# EasyEDA schematic SCH_BusTemp_2026-09-07.json
TITLE: Sheet_1; REV: 1.0; Date: 2021-08-14; Sheet: 1/1; Drawn By: Ananthapadmanaban gururajan; Company: Your Company
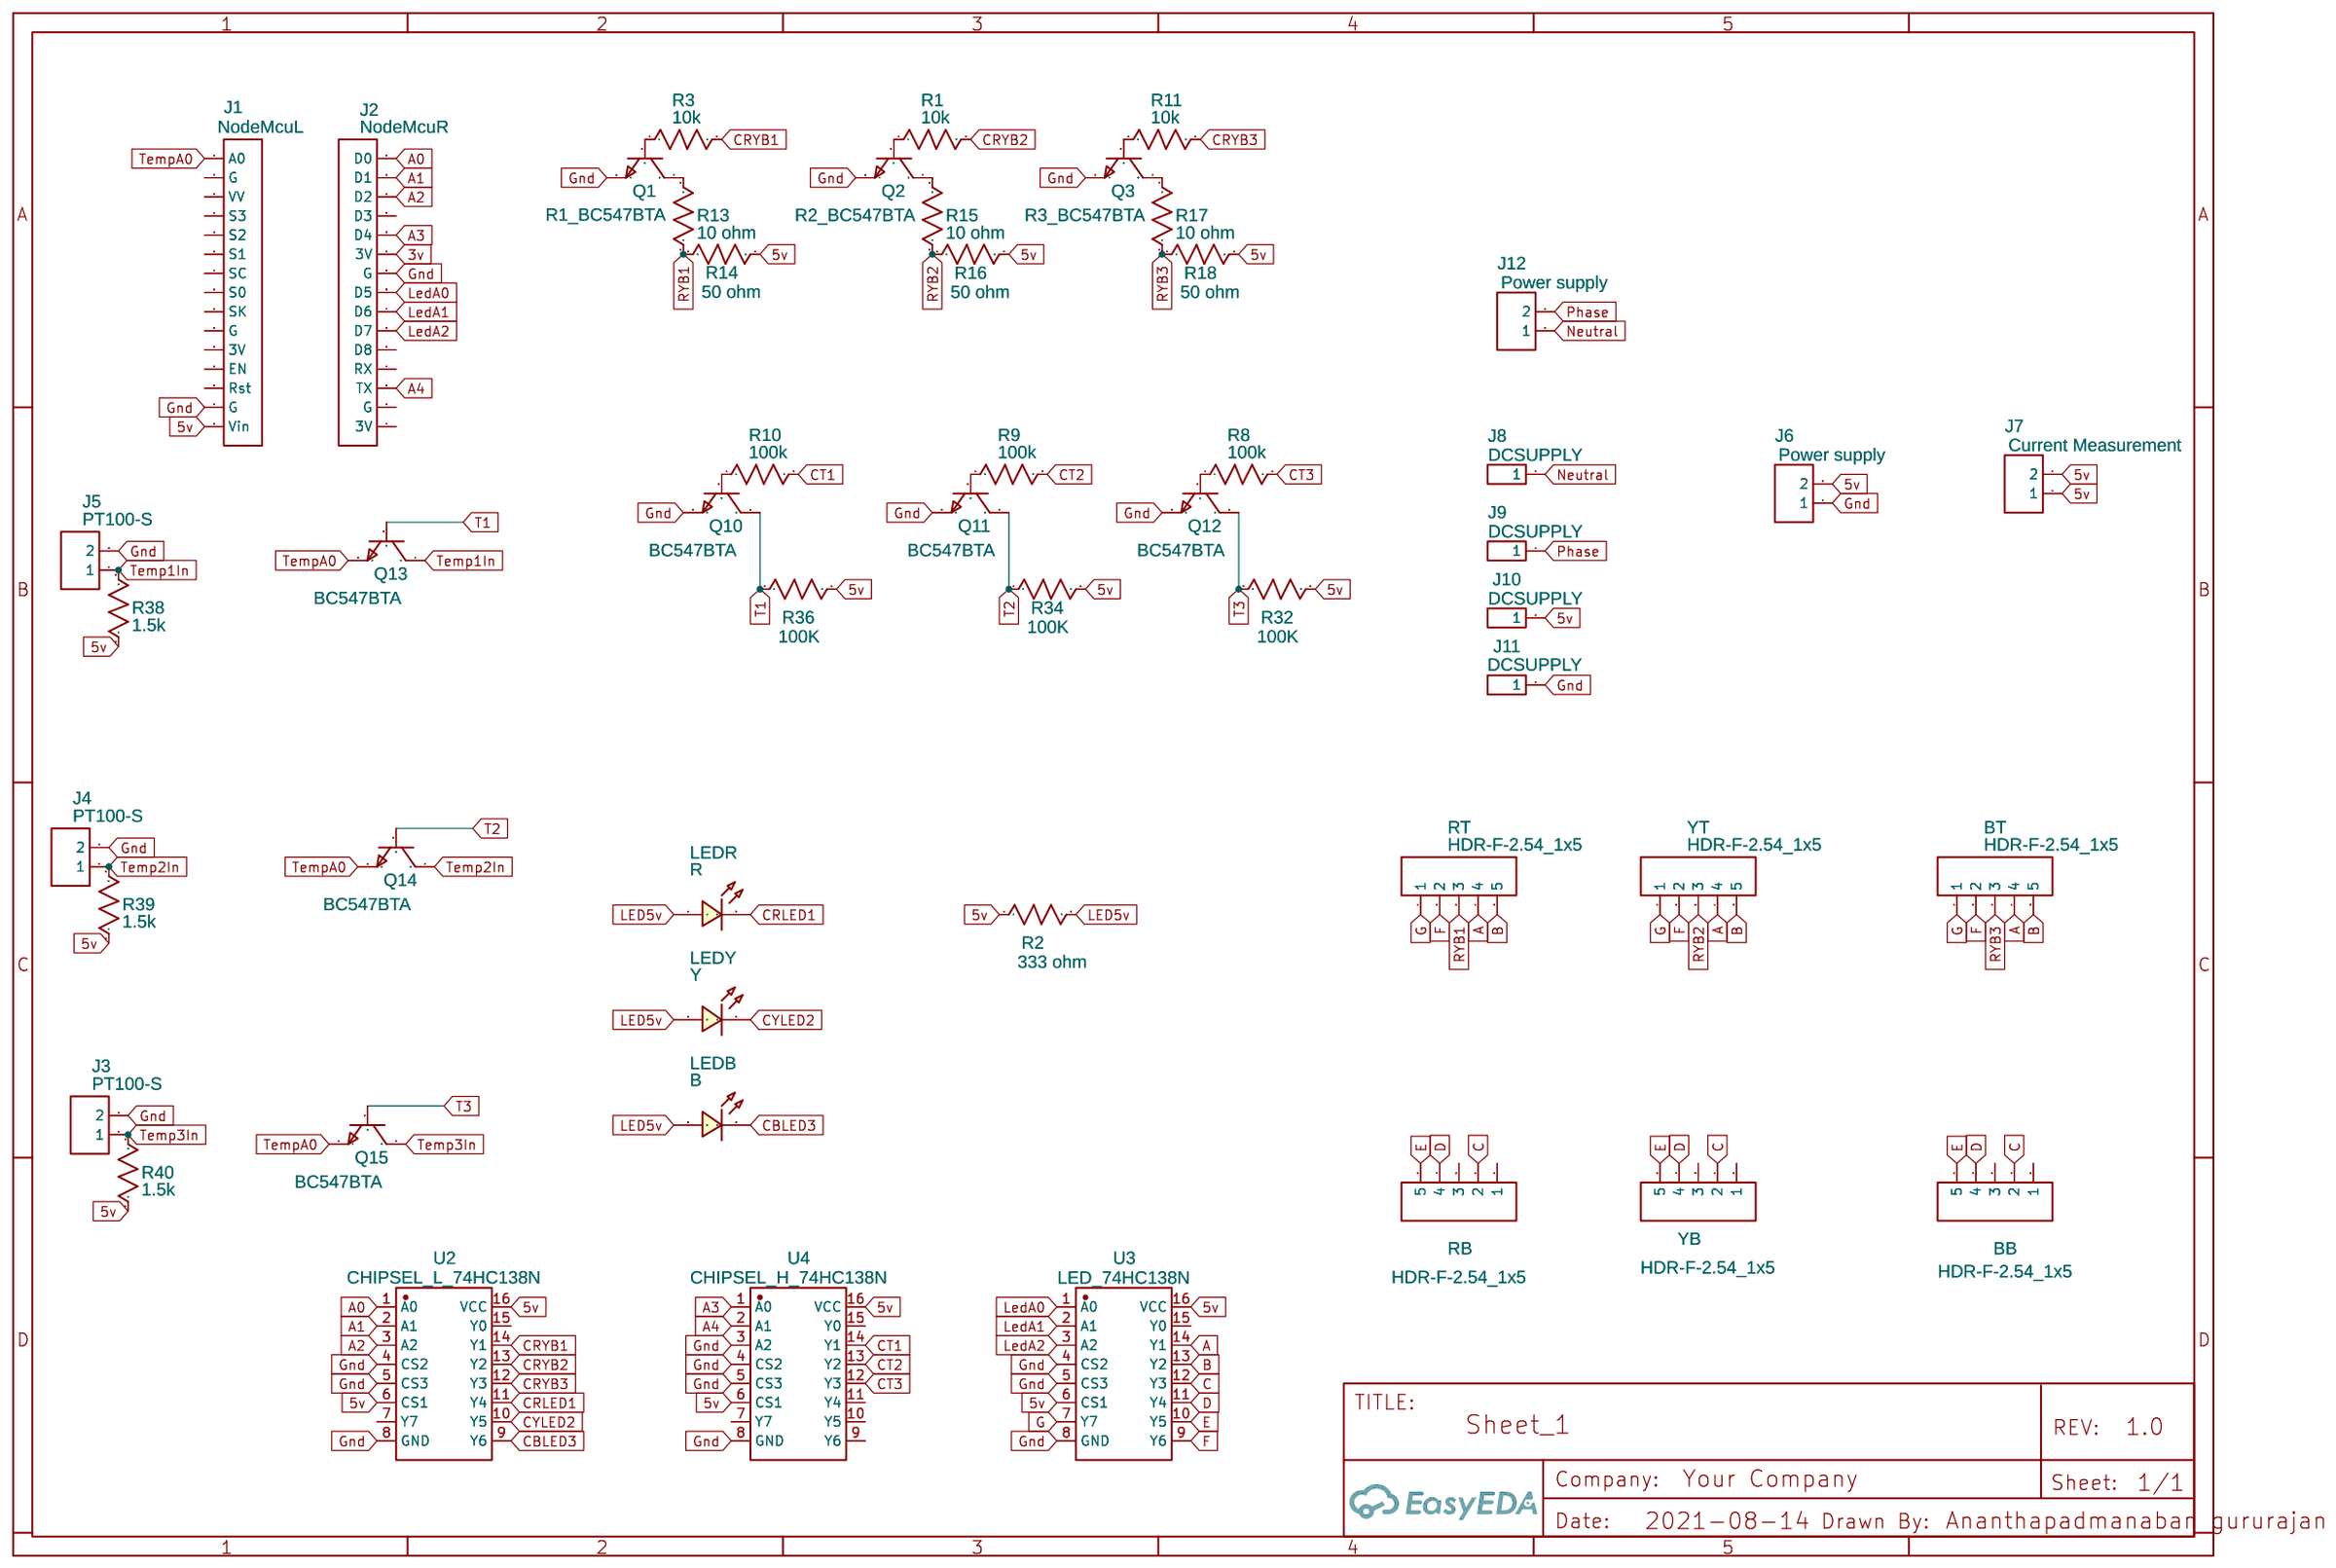
[diagram p0: schematic sheet]

## Parts
BB  HDR-F-2.54_1x5  [HDR-F-2.54_1X5]
BT  HDR-F-2.54_1x5  [HDR-F-2.54_1X5]
J1  NodeMcuL  [HDR-M-2.54_1X15]
J2  NodeMcuR  [HDR-M-2.54_1X15]
J3  PT100-S  [HDR-M-2.54_1X2]
J4  PT100-S  [HDR-M-2.54_1X2]
J5  PT100-S  [HDR-M-2.54_1X2]
J6  Power supply  [HDR-M-2.54_1X2]
J7  Current Measurement  [HDR-M-2.54_1X2]
J8  DCSUPPLY  [HDR-M-2.54_1X1]
J9  DCSUPPLY  [HDR-M-2.54_1X1]
J10  DCSUPPLY  [HDR-M-2.54_1X1]
J11  DCSUPPLY  [HDR-M-2.54_1X1]
J12  Power supply  [HDR-M-2.54_1X2]
LEDB  B  [LED-TH_BD3.0_BLUE]
LEDR  R  [LED-TH_BD3.0_RED]
LEDY  Y  [LED-TH_BD3.0_GREEN]
Q1  R1_BC547BTA  [TO-92-3_L4.8-W3.7-P2.54-L]
Q2  R2_BC547BTA  [TO-92-3_L4.8-W3.7-P2.54-L]
Q3  R3_BC547BTA  [TO-92-3_L4.8-W3.7-P2.54-L]
Q10  BC547BTA  [TO-92-3_L4.8-W3.7-P2.54-L]
Q11  BC547BTA  [TO-92-3_L4.8-W3.7-P2.54-L]
Q12  BC547BTA  [TO-92-3_L4.8-W3.7-P2.54-L]
Q13  BC547BTA  [TO-92-3_L4.8-W3.7-P2.54-L]
Q14  BC547BTA  [TO-92-3_L4.8-W3.7-P2.54-L]
Q15  BC547BTA  [TO-92-3_L4.8-W3.7-P2.54-L]
R1  10k  [R_AXIAL-0.3]
R2  333 ohm  [R_AXIAL-0.3]
R3  10k  [R_AXIAL-0.3]
R8  100k  [R_AXIAL-0.3]
R9  100k  [R_AXIAL-0.3]
R10  100k  [R_AXIAL-0.3]
R11  10k  [R_AXIAL-0.3]
R13  10 ohm  [R_AXIAL-0.3]
R14  50 ohm  [R_AXIAL-0.3]
R15  10 ohm  [R_AXIAL-0.3]
R16  50 ohm  [R_AXIAL-0.3]
R17  10 ohm  [R_AXIAL-0.3]
R18  50 ohm  [R_AXIAL-0.3]
R32  100K  [R_AXIAL-0.3]
R34  100K  [R_AXIAL-0.3]
R36  100K  [R_AXIAL-0.3]
R38  1.5k  [R_AXIAL-0.3]
R39  1.5k  [R_AXIAL-0.3]
R40  1.5k  [R_AXIAL-0.3]
RB  HDR-F-2.54_1x5  [HDR-F-2.54_1X5]
RT  HDR-F-2.54_1x5  [HDR-F-2.54_1X5]
U2  CHIPSEL_L_74HC138N  [DIP-16_L19.2-W6.6-P2.54-LS7.6-BL]
U3  LED_74HC138N  [DIP-16_L19.2-W6.6-P2.54-LS7.6-BL]
U4  CHIPSEL_H_74HC138N  [DIP-16_L19.2-W6.6-P2.54-LS7.6-BL]
YB  HDR-F-2.54_1x5  [HDR-F-2.54_1X5]
YT  HDR-F-2.54_1x5  [HDR-F-2.54_1X5]

## Library data of the parts
BB BT RB RT YB YT = HDR-F-2.54_1x5: Supplier Part: C50950; Supplier: LCSC; Contributor: LCEDA_Lib
J1 J2 = HDR-M-2.54_1x15: Supplier Part: C124373; Supplier: LCSC; Contributor: LCEDA_Lib
J3-J7 J12 = HDR-M-2.54_1x2: Supplier Part: C124375; Supplier: LCSC; Contributor: LCEDA_Lib
J8-J11 = HDR-M-2.54_1x1: Supplier Part: C81276; Supplier: LCSC; Contributor: LCEDA_Lib
LEDB = LED-TH-3mm_B: Manufacturer: EVERLIGHT(台湾亿光); Manufacturer Part: 204-10SUBC/S400-A4; Supplier Part: C86881; Supplier: LCSC; Contributor: LCEDA_Lib
LEDR = LED-TH-3mm_R: Manufacturer: EVERLIGHT(台湾亿光); Manufacturer Part: 204-10SDRD/S530-A3-L; Supplier Part: C84774; Supplier: LCSC; Contributor: LCEDA_Lib
LEDY = LED-TH-3mm_G: Manufacturer: EVERLIGHT(台湾亿光); Manufacturer Part: 204-10SYGD/S530-E3; Supplier Part: C85161; Contributor: LCEDA_Lib
Q1-Q3 Q10-Q15 = BC547BTA: Supplier: LCSC; Supplier Part: C258144; Manufacturer: ON Semicon; Contributor: LCSC
R1-R3 R8-R11 R13-R18 R32 R34 R36 R38-R40 = R_AXIAL-0.3_US: Contributor: LCEDA_Lib
U2-U4 = 74HC138N: Supplier: LCSC; Supplier Part: C507188; Manufacturer: HGSEMI; Contributor: LCSC; JLCPCB Part Class: Extended Part

## Nets
3v: J2.10(3V)
5v: J1.15(Vin) J6.2 J7.1 J7.2 J10.1 R2.1 R14.2 R16.2 R18.2 R32.2 R34.2 R36.2 R38.1 R39.1 R40.1 U2.6(CS1) U2.16(VCC) U3.6(CS1) U3.16(VCC) U4.6(CS1) U4.16(VCC)
Gnd: J1.14(G) J2.9(G) J3.2 J4.2 J5.2 J6.1 J11.1 Q1.3(E) Q2.3(E) Q3.3(E) Q10.3(E) Q11.3(E) Q12.3(E) U2.4(CS2) U2.5(CS3) U2.8(GND) U3.4(CS2) U3.5(CS3) U3.8(GND) U4.3(A2) U4.4(CS2) U4.5(CS3) U4.8(GND)
A: BT.4 RT.4 U3.14(Y1) YT.4
A0: J2.15(D0) U2.1(A0)
A1: J2.14(D1) U2.2(A1)
A2: J2.13(D2) U2.3(A2)
A3: J2.11(D4) U4.1(A0)
A4: J2.3(TX) U4.2(A1)
B: BT.5 RT.5 U3.13(Y2) YT.5
C: BB.2 RB.2 U3.12(Y3) YB.2
CBLED3: LEDB.2 U2.9(Y6)
CRLED1: LEDR.2 U2.11(Y4)
CRYB1: R3.2 U2.14(Y1)
CRYB2: R1.2 U2.13(Y2)
CRYB3: R11.2 U2.12(Y3)
CT1: R10.2 U4.14(Y1)
CT2: R9.2 U4.13(Y2)
CT3: R8.2 U4.12(Y3)
CYLED2: LEDY.2 U2.10(Y5)
D: BB.4 RB.4 U3.11(Y4) YB.4
E: BB.5 RB.5 U3.10(Y5) YB.5
F: BT.2 RT.2 U3.9(Y6) YT.2
G: BT.1 RT.1 U3.7(Y7) YT.1
LED5v: LEDB.1 LEDR.1 LEDY.1 R2.2
LedA0: J2.8(D5) U3.1(A0)
LedA1: J2.7(D6) U3.2(A1)
LedA2: J2.6(D7) U3.3(A2)
Neutral: J8.1 J12.1
Phase: J9.1 J12.2
RYB1: R13.1 R14.1 RT.3
RYB2: R15.1 R16.1 YT.3
RYB3: BT.3 R17.1 R18.1
T1: Q10.1(C) Q13.2(B) R36.1
T2: Q11.1(C) Q14.2(B) R34.1
T3: Q12.1(C) Q15.2(B) R32.1
Temp1In: J5.1 Q13.1(C) R38.2
Temp2In: J4.1 Q14.1(C) R39.2
Temp3In: J3.1 Q15.1(C) R40.2
TempA0: J1.1(A0) Q13.3(E) Q14.3(E) Q15.3(E)
Net-(Q1-1): Q1.1(C) R13.2
Net-(Q1-2): Q1.2(B) R3.1
Net-(Q2-1): Q2.1(C) R15.2
Net-(Q2-2): Q2.2(B) R1.1
Net-(Q3-1): Q3.1(C) R17.2
Net-(Q3-2): Q3.2(B) R11.1
Net-(Q10-2): Q10.2(B) R10.1
Net-(Q11-2): Q11.2(B) R9.1
Net-(Q12-2): Q12.2(B) R8.1

Not connected (* = marked no-connect by the designer): BB 1 3; J1 2(G) 3(VV) 4(S3) 5(S2) 6(S1) 7(SC) 8(S0) 9(SK) 10(G) 11(3V) 12(EN) 13(Rst); J2 1(3V) 2(G) 4(RX) 5(D8) 12(D3); RB 1 3; U2 7(Y7) 15(Y0); U3 15(Y0); U4 7(Y7) 9(Y6) 10(Y5) 11(Y4) 15(Y0); YB 1 3
